# Altium schematic sheet ICD4_Interface_Module.SchDoc
size A; SheetNumber: 3; SheetTotal: 7
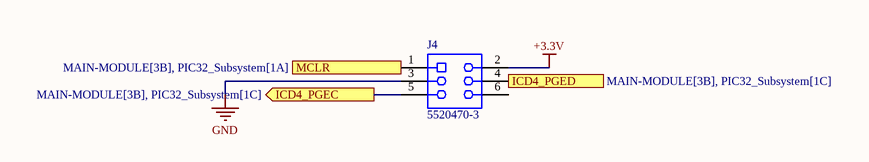
[diagram p0: ICD4_Interface_Module.SchDoc]

## Parts
J4  5520470-3  [TECO-5520470-3_V]

## Ports
ICD4_PGEC (out, see MAIN-MODULE[3B], PIC32_Subsystem[1C]), ICD4_PGED (out, see MAIN-MODULE[3B], PIC32_Subsystem[1C]), MCLR (out, see MAIN-MODULE[3B], PIC32_Subsystem[1A])

## Nets
+3.3V: J4.2
GND: J4.3
ICD4_PGEC: J4.5 ; port ICD4_PGEC
ICD4_PGED: J4.4 ; port ICD4_PGED
MCLR: J4.1 ; port MCLR

Not connected (* = marked no-connect by the designer): J4 6

## Library data of the parts
J4 = CMP-1682-00001-5: Modular Jack, 6 Position, Right Angle, RoHS, Tray; Manufacturer: TE Connectivity; Voltage Rating: 150 V; Current Rating: 1.5 A; Lead Pitch: 2.54 mm; Contact Material: Bronze; RoHSCompliant: true; Contact Finish: Gold; REACH SVHC: Unknown; Height: 16.13 mm; Colour: Black; ComponentLink1Description: Manufacturer URL; PackageDescription: Female Header, Pitch 1.27 mm, 2 x 3 Position, Height 16.13 mm, Tail Length 4.32 mm; ComponentLink2URL: http://www.te.com/commerce/DocumentDelivery/DDEController?Action=srchrtrv&DocNm=5520470&DocType=Customer+Drawing&DocLang=English; ComponentLink2Description: Datasheet; Package Quantity: 176; Pins: 6; Length: 13.34 mm; Packaging: Tray; Contact Plating: Gold; Housing Material: PBT; Max Voltage Rating (AC): 150 V; ComponentLink1URL: http://www.te.com/; Mount: Through Hole; DatasheetVersion: Rev. B1, 03/2011; PackageReference: 5520470-3; Mounting Technology: Through Hole